# EasyEDA Pro project 数控电源_V3.eprj, schematic 电源板, sheet 1 of 2

## Sheets
1 主控3: Board Name: 电源板; Create Date: 2025-11-30; Page Name: 主控3; Project Name: 数控电源_V3; Schematic Name: 电源板; Update Date: 2025-11-30; Company: 嘉立创EDA; Page Size: A2; Version: V3
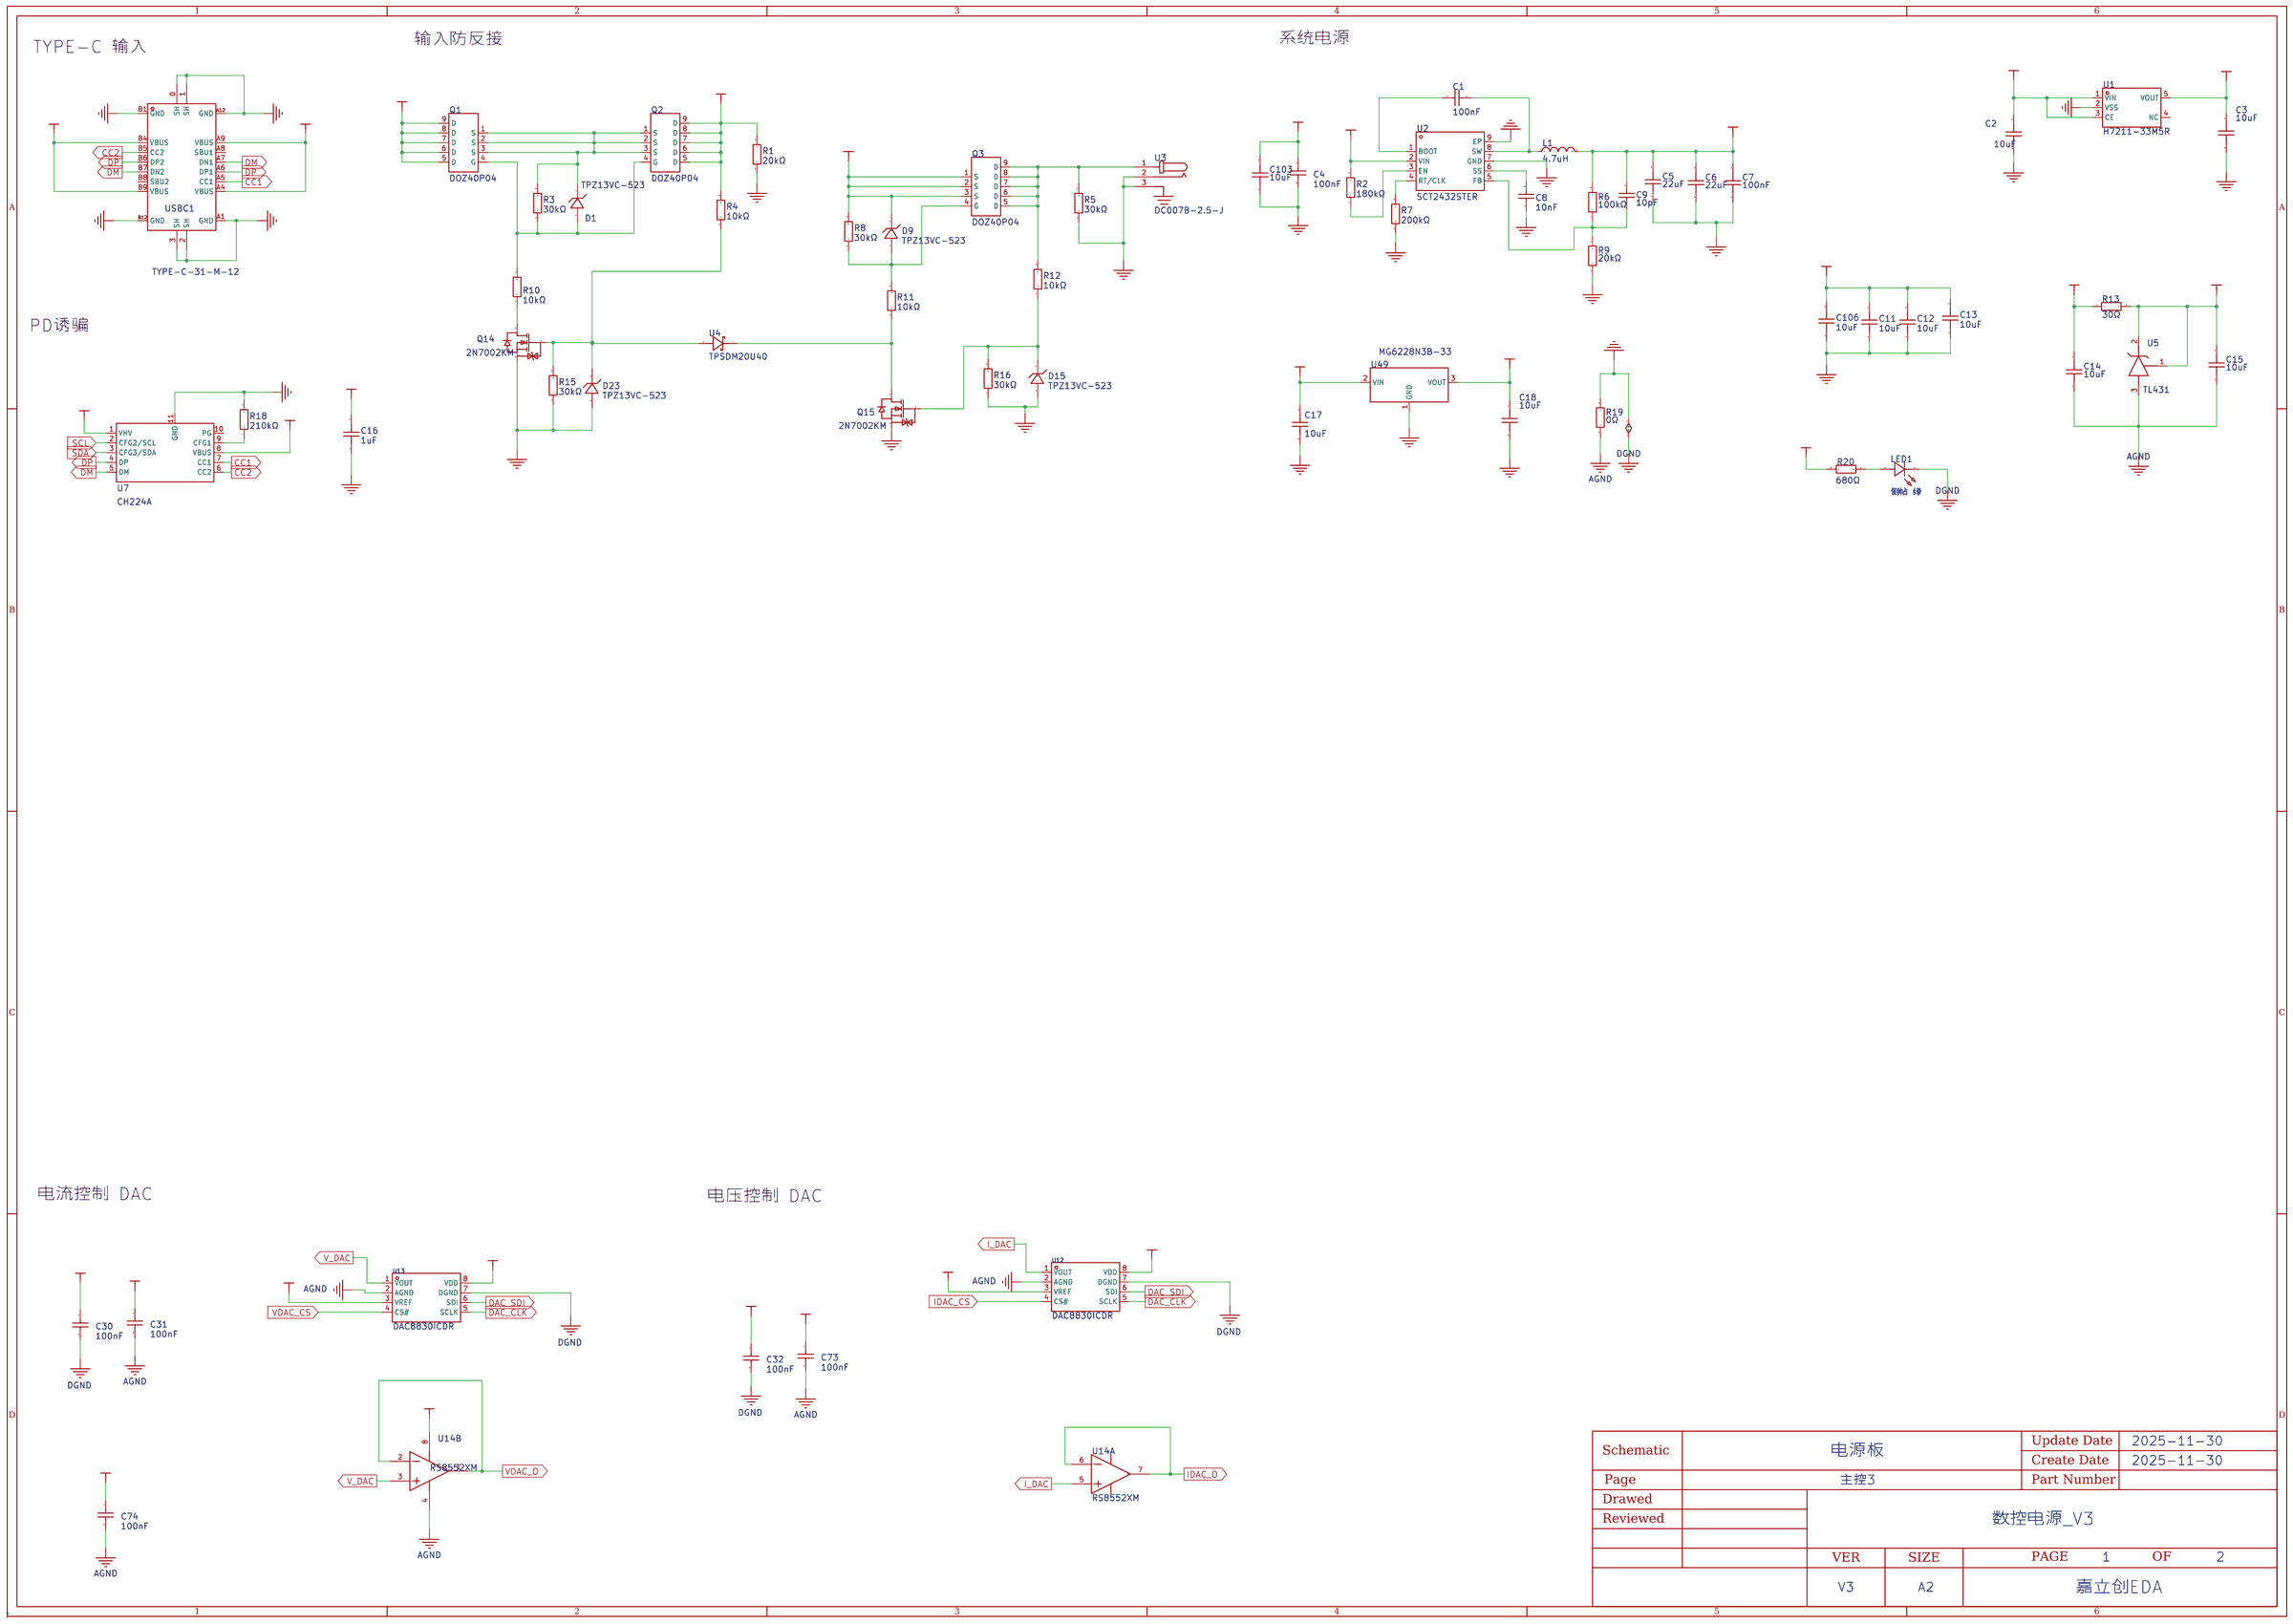
[diagram p3: 主控3]

## Parts
C1  100nF  [C0402]
C2  10uF  [电容0402]
C3  10uF  [电容0402]
C4  100nF  [C0402]
C5  22uF  [C0805]
C6  22uF  [C0805]
C7  100nF  [C0402]
C8  10nF  [C0402]
C9  10pF  [C0402]
C11  10uF  [C0402]
C12  10uF  [C0402]
C13  10uF  [C0402]
C14  10uF  [电容0603]
C15  10uF  [电容0603]
C16  1uF  [C0603]
C17  10uF  [电容0402]
C18  10uF  [电容0402]
C30  100nF  [C0402]
C31  100nF  [C0402]
C32  100nF  [C0402]
C73  100nF  [C0402]
C74  100nF  [C0402]
C103  10uF  [C0805]
C106  10uF  [C0402]
D1  TPZ13VC-523  [SOD-523_L1.2-W0.8-LS1.6-RD]
D9  TPZ13VC-523  [SOD-523_L1.2-W0.8-LS1.6-RD]
D15  TPZ13VC-523  [SOD-523_L1.2-W0.8-LS1.6-RD]
D23  TPZ13VC-523  [SOD-523_L1.2-W0.8-LS1.6-RD]
L1  4.7uH  [IND-SMD_L7.0-W6.6]
LED1  侧帖 绿  [LED-SMD_L1.7-W1.1-R-RD_GREEN]
Q1  DOZ40P04  [PDFN-8_L3.1-W3.1-P0.65-LS3.4-BL]
Q2  DOZ40P04  [PDFN-8_L3.1-W3.1-P0.65-LS3.4-BL]
Q3  DOZ40P04  [PDFN-8_L3.1-W3.1-P0.65-LS3.4-BL]
Q14  2N7002KM  [SOT-723-3_L1.2-W0.8-P0.80-LS1.2-BR]
Q15  2N7002KM  [SOT-723-3_L1.2-W0.8-P0.80-LS1.2-BR]
R1  20kΩ  [R0402]
R2  180kΩ  [R0402]
R3  30kΩ  [R0402]
R4  10kΩ  [R0402]
R5  30kΩ  [R0402]
R6  100kΩ  [R0402]
R7  200kΩ  [R0402]
R8  30kΩ  [R0402]
R9  20kΩ  [R0402]
R10  10kΩ  [R0402]
R11  10kΩ  [R0402]
R12  10kΩ  [R0402]
R13  30Ω  [R0805_NEW]
R15  30kΩ  [R0402]
R16  30kΩ  [R0402]
R18  210kΩ  [R0402]
R19  0Ω  [R1206]
R20  680Ω  [R0402]
U1  H7211-33M5R  [SOT-23-5_L3.0-W1.7-P0.95-LS2.8-BL]
U2  SCT2432STER  [ESOP-8_L4.9-W3.9-P1.27-LS6.0-BL-EP]
U3  DC007B-2.5-J  [DC-IN-TH_HX-DC007B-2.5]
U4  TPSDM20U40  [SOD-523_L1.2-W0.8-LS1.6-RD]
U5  TL431  [SOT-23-3_L2.9-W1.3-P1.90-LS2.4-BR]
U7  CH224A  [ESSOP-10_L4.9-W3.9-P1.0-LS6.0-TL-EP]
U12  DAC8830ICDR  [SOIC-8_L4.9-W3.9-P1.27-LS6.0-BL]
U13  DAC8830ICDR  [SOIC-8_L4.9-W3.9-P1.27-LS6.0-BL]
U14  RS8552XM  [MSOP-8_L3.0-W3.0-P0.65-LS4.9-BL]  (sections 1,2)
U49  MG6228N3B-33  [SOT-89-3_L4.5-W2.5-P1.50-LS4.2-BR]
USBC1  TYPE-C-31-M-12  [USB-C_SMD-TYPE-C-31-M-12]

## Library data of the parts
C1 C4 C30-C32 C73 C74 = CC0402KRX7R9BB104: 容值:100nF;精度:±10%;额定电压:50V;材质(温度系数):X7R;; LCSC Part Name: 100nF ±10% 50V; Supplier Part: C131394; Manufacturer: YAGEO(国巨); Supplier Footprint: 0402; JLCPCB Part Class: Extended Part; Datasheet: https://atta.szlcsc.com/upload/public/pdf/source/20170925/C131394_1506321459057990237.pdf; Supplier: LCSC; Tolerance: ±10%; Voltage Rated: 50V; Temperature Coefficient: X7R
C2 C3 C17 C18 = CL05A106MP5NUNC: 容值:10uF;精度:±20%;额定电压:10V;材质(温度系数):X5R;; LCSC Part Name: 10uF ±20% 10V; Supplier Part: C315248; Manufacturer: SAMSUNG(三星); Supplier Footprint: 0402; JLCPCB Part Class: Extended Part; Datasheet: https://atta.szlcsc.com/upload/public/pdf/source/20231220/1EF805BAE1520675928CC4638D279E74.pdf; Supplier: LCSC; Tolerance: ±20%; Voltage Rated: 10V; Temperature Coefficient: X5R
C5 C6 = CL21A226MAQNNNE_C45783: 容值:22uF;精度:±20%;额定电压:25V;材质(温度系数):X5R;; LCSC Part Name: 22uF ±20% 25V; Supplier Part: C45783; Manufacturer: SAMSUNG(三星); Manufacturer Part: CL21A226MAQNNNE; Supplier Footprint: 0805; JLCPCB Part Class: Basic Part; Datasheet: https://atta.szlcsc.com/upload/public/pdf/source/20160103/1457707727161.pdf; Supplier: LCSC; Tolerance: ±20%; Voltage Rated: 25V; Temperature Coefficient: X5R
C7 = CL05B104KB54PNC: 容值:100nF;精度:±10%;额定电压:50V;材质(温度系数):X7R;; LCSC Part Name: 100nF ±10% 50V; Supplier Part: C307331; Manufacturer: SAMSUNG(三星); Supplier Footprint: 0402; JLCPCB Part Class: Basic Part; Datasheet: https://atta.szlcsc.com/upload/public/pdf/source/20181009/C307331_222F7C870FD3EA5F46F538B483443886.pdf; Supplier: LCSC; Tolerance: ±10%; Voltage Rated: 50V; Temperature Coefficient: X7R
C8 = CC0402KRX7R9BB103: 容值:10nF;精度:±10%;额定电压:50V;材质(温度系数):X7R;; LCSC Part Name: 10nF ±10% 50V; Supplier Part: C60133; Manufacturer: YAGEO(国巨); Supplier Footprint: 0402; JLCPCB Part Class: 扩展库; Datasheet: https://atta.szlcsc.com/upload/public/pdf/source/20180224/C181747_15194369449651363981.pdf; Supplier: LCSC; Tolerance: ±10%; Voltage Rated: 50V; Temperature Coefficient: X7R
C9 = GRM1555C1H100JA01D: 容值:10pF;精度:±5%;额定电压:50V;材质(温度系数):C0G;; LCSC Part Name: 10pF ±5% 50V; Supplier Part: C76946; Manufacturer: muRata(村田); Supplier Footprint: 0402; JLCPCB Part Class: 扩展库; Datasheet: https://atta.szlcsc.com/upload/public/pdf/source/20180307/C76946_15204091154331407734.pdf; Supplier: LCSC; Tolerance: ±5%; Voltage Rated: 50V; Temperature Coefficient: C0G
C11-C13 C106 = HGC0402R5106M100NTEJ: 容值:10uF;精度:±20%;额定电压:10V;材质(温度系数):X5R;; LCSC Part Name: 10uF ±20% 10V; Supplier Part: C7472949; Manufacturer: Chinocera(华瓷); Supplier Footprint: 0402; JLCPCB Part Class: 扩展库; Datasheet: https://atta.szlcsc.com/upload/public/pdf/source/20240320/FAC3FEC40A78BC5CCCE96C232A94D860.pdf; Supplier: LCSC; Tolerance: ±20%; Voltage Rated: 10V; Temperature Coefficient: X5R
C14 C15 = 0603_10uF_10V: 容值:10uF;精度:±10%;额定电压:10V;材质(温度系数):X5R;; LCSC Part Name: 10uF ±10% 10V; Supplier Part: C19702; Manufacturer: SAMSUNG(三星); Manufacturer Part: CL10A106KP8NNNC; Supplier Footprint: 0603; JLCPCB Part Class: 基础库; Datasheet: https://atta.szlcsc.com/upload/public/pdf/source/20160103/1457707703378.pdf; Supplier: LCSC; Tolerance: ±10%; Voltage Rated: 10V; Temperature Coefficient: X5R
C16 = CL10A105KB8NNNC: 容值:1uF;精度:±10%;额定电压:50V;材质(温度系数):X5R;; LCSC Part Name: 1uF ±10% 50V; Supplier Part: C15849; Manufacturer: SAMSUNG(三星); Supplier Footprint: 0603; JLCPCB Part Class: Basic Part; Datasheet: https://atta.szlcsc.com/upload/public/pdf/source/20160103/1457707679084.pdf; Supplier: LCSC; Tolerance: ±10%; Voltage Rated: 50V; Temperature Coefficient: X5R
C103 = HGC0805R5106K500NSLJ: 容值:10uF;精度:±10%;额定电压:50V;温度系数:X5R;; LCSC Part Name: 10uF ±10% 50V; Supplier Part: C22367830; Manufacturer: Chinocera(华瓷); Supplier Footprint: 0805; JLCPCB Part Class: Extended Part; Datasheet: https://atta.szlcsc.com/upload/public/pdf/source/20240326/4C0A3E12027C78BBE9280625046EA2CF.pdf; Supplier: LCSC; Tolerance: ±10%; Voltage Rating: 50V; Temperature Coefficient: X5R
D1 D9 D15 D23 = LM5Z12VT1G: 二极管配置:独立式;稳压值(标称值):12V;稳压值(范围):11.4V~12.7V;功率(Pd):200mW;; Supplier Part: C131801; Manufacturer: LRC(乐山无线电); Supplier Footprint: SOD-523; JLCPCB Part Class: 扩展库; Datasheet: https://atta.szlcsc.com/upload/public/pdf/source/20190903/C383222_2E9F08E52083C1CC5E8563C6B9858127.pdf; Supplier: LCSC; Diode Configuration: 独立式; Zener Voltage (Nom): 12V; Zener Voltage (Range): 11.4V~12.7V; Power Dissipation: 200mW; Zener Impedance (Zzt): 25Ω
L1 = FXL0630-4R7-M: 电感值:4.7uH;精度:±20%;额定电流:6A;饱和电流(Isat):9A;类型:一体成型电感;; LCSC Part Name: 4.7uH ±20% 9A; Supplier Part: C167220; Manufacturer: cjiang(长江微电); Supplier Footprint: SMD,6.6x7mm; JLCPCB Part Class: 扩展库; Datasheet: https://atta.szlcsc.com/upload/public/pdf/source/20240426/3189EA8206330E2108542F9E34E540E7.pdf; Supplier: LCSC; Tolerance: ±20%; Rated Current: 6A; Saturation Current (Isat): 9A; DC Resistance (DCR): 33mΩ; Type: 一体成型电感
LED1 = XL-1606UGC: 发光颜色:翠绿;主波长:520nm~530nm;色温:-;功率:80mW;安装方式:侧贴;; LCSC Part Name: 翠绿 侧贴; Supplier Part: C965863; Manufacturer: XINGLIGHT(成兴光); Supplier Footprint: SMD,1.1x1.7mm; JLCPCB Part Class: 扩展库; Datasheet: https://atta.szlcsc.com/upload/public/pdf/source/20221102/94FA3AB05D9E652787BBD0AFAAE97065.pdf; Supplier: LCSC; Emitted Color: 翠绿; Lens Color: 无色透明; Dominant Wavelength: 520nm~530nm; Peak Wavelength: 535nm; Forward Current: 25mA; Power Dissipation: 80mW; Viewing Angle: 120°; Mounting Sytle: 侧贴; Operating Temperature: -30℃~+85℃
Q1-Q3 = DOZ40P04: 数量:1个P沟道;漏源电压(Vdss):40V;连续漏极电流(Id):40A;导通电阻(RDS(on)):15mΩ@10V;耗散功率(Pd):40W;阈值电压(Vgs(th)):2.5V@250uA;; Supplier Part: C42420925; Manufacturer: DOINGTER(杜因特); Supplier Footprint: DFN-8(3x3); Datasheet: https://atta.szlcsc.com/upload/public/pdf/source/20241224/BFD251454FAEA74D5A9CEDD45C52E1FA.pdf; Supplier: LCSC; Number: 1个P沟道; Drain to Source Voltage: 40V; Current - Continuous Drain(Id): 40A; RDS(on): 15mΩ@10V; Pd - Power Dissipation: 40W; Gate Threshold Voltage (Vgs(th)@Id): 2.5V@250uA; Gate Charge(Qg): 41nC@10V; Input Capacitance(Ciss): 3.119nF@20V; Reverse Transfer Capacitance (Crss@Vds): 215pF@20V; Operating Temperature: -55℃~+150℃; Type: P沟道; Output Capacitance(Coss): 270pF
Q14 Q15 = 2N7002KM_C7528888: 数量:1个N沟道;漏源电压(Vdss):60V;连续漏极电流(Id):340mA;导通电阻(RDS(on)):1.3Ω@10V,500mA;耗散功率(Pd):150mW;阈值电压(Vgs(th)):1V;; LCSC Part Name: N沟道,电流:0.34A,耐压:60V; Supplier Part: C7528888; Manufacturer: AM(安美); Supplier Footprint: SOT-723; JLCPCB Part Class: 扩展库; Datasheet: https://atta.szlcsc.com/upload/public/pdf/source/20231129/5C66841134DDA0BD991D299F08DBA333.pdf; Supplier: LCSC; Number: 1个N沟道; Drain to Source Voltage: 60V; Current - Continuous Drain(Id): 340mA; RDS(on): 1.3Ω@10V,500mA; Pd - Power Dissipation: 150mW; Gate Threshold Voltage (Vgs(th)@Id): 1V; Input Capacitance(Ciss@Vds): 40pF@10V; Reverse Transfer Capacitance (Crss@Vds): 10pF@10V; Operating Temperature: -55℃~+150℃
R1 R9 = 0402WGF2002TCE: 电阻类型:厚膜电阻;阻值:20kΩ;精度:±1%;功率:62.5mW;; LCSC Part Name: 20kΩ ±1% 62.5mW; Supplier Part: C25765; Manufacturer: UNI-ROYAL(厚声); Supplier Footprint: 0402; JLCPCB Part Class: 基础库; Datasheet: https://atta.szlcsc.com/upload/public/pdf/source/20200306/C422600_1E6D84923E4A46A82E41ADD87F860B5C.pdf; Supplier: LCSC; Type: 厚膜电阻; Tolerance: ±1%; Power(Watts): 62.5mW; Temperature Coefficient: ±100ppm/℃; Overload Voltage (Max): 50V; Operating Temperature Range: -55℃~+155℃
R2 = 0402WGF1803TCE: 电阻类型:厚膜电阻;阻值:180kΩ;精度:±1%;功率:62.5mW;最大工作电压:50V;温度系数:±100ppm/℃;; LCSC Part Name: 180kΩ ±1% 62.5mW 厚膜电阻; Supplier Part: C25760; Manufacturer: UNI-ROYAL(厚声); Supplier Footprint: 0402; JLCPCB Part Class: 扩展库; Datasheet: https://atta.szlcsc.com/upload/public/pdf/source/20200306/C422600_1E6D84923E4A46A82E41ADD87F860B5C.pdf; Supplier: LCSC; Type: 厚膜电阻; Tolerance: ±1%; Power(Watts): 62.5mW; Overload Voltage (Max): 50V; Temperature Coefficient: ±100ppm/℃; Operating Temperature Range: -55℃~+155℃
R3 R8 R15 R16 = RC0402FR-0730KL: 电阻类型:厚膜电阻;阻值:30kΩ;精度:±1%;功率:62.5mW;温度系数:±100ppm/℃;最大工作电压:50V;工作温度范围:-55℃~+155℃;; LCSC Part Name: 30kΩ ±1% 62.5mW; Supplier Part: C138008; Manufacturer: YAGEO(国巨); Supplier Footprint: 0402; JLCPCB Part Class: Extended Part; Datasheet: https://atta.szlcsc.com/upload/public/pdf/source/20171107/C138008_15100516356731096935.pdf; Supplier: LCSC; Type: 厚膜电阻; Tolerance: ±1%; Power(Watts): 62.5mW; Temperature Coefficient: ±100ppm/℃; Overload Voltage (Max): 50V; Operating Temperature Range: -55℃~+155℃
R4 R6 R10-R12 = RC0402FR-07100KL: 电阻类型:厚膜电阻;阻值:100kΩ;精度:±1%;功率:62.5mW;; LCSC Part Name: 100kΩ ±1% 62.5mW; Supplier Part: C60491; Manufacturer: YAGEO(国巨); Supplier Footprint: 0402; JLCPCB Part Class: Extended Part; Datasheet: https://atta.szlcsc.com/upload/public/pdf/source/20170518/1495086055123.pdf; Supplier: LCSC; Type: 厚膜电阻; Tolerance: ±1%; Power(Watts): 62.5mW; Temperature Coefficient: ±100ppm/℃; Overload Voltage (Max): 50V; Operating Temperature Range: -55℃~+155℃
R5 = FRC0402F3002TS: 电阻类型:厚膜电阻;阻值:30kΩ;精度:±1%;功率:62.5mW;工作电压:50V;温度系数:±100ppm/℃;; LCSC Part Name: 30kΩ ±1% 62.5mW 厚膜电阻; Supplier Part: C2909347; Manufacturer: FOJAN(富捷); Supplier Footprint: 0402; JLCPCB Part Class: Extended Part; Datasheet: https://atta.szlcsc.com/upload/public/pdf/source/20211221/925EC7D7225764EE0046F22065062C87.pdf; Supplier: LCSC; Type: 厚膜电阻; Tolerance: ±1%; Power(Watts): 62.5mW; Voltage-Supply(Max): 50V; Temperature Coefficient: ±100ppm/℃; Operating Temperature: -55℃~+155℃
R7 = 0402WGF2003TCE: 电阻类型:厚膜电阻;阻值:200kΩ;精度:±1%;功率:62.5mW;; LCSC Part Name: 200kΩ ±1% 62.5mW; Supplier Part: C25764; Manufacturer: UNI-ROYAL(厚声); Supplier Footprint: 0402; JLCPCB Part Class: 基础库; Datasheet: https://atta.szlcsc.com/upload/public/pdf/source/20200306/C422600_1E6D84923E4A46A82E41ADD87F860B5C.pdf; Supplier: LCSC; Type: 厚膜电阻; Tolerance: ±1%; Power(Watts): 62.5mW; Temperature Coefficient: ±100ppm/℃; Overload Voltage (Max): 50V; Operating Temperature Range: -55℃~+155℃
R13 = 0805W8F300JT5E: 电阻类型:厚膜电阻;阻值:30Ω;精度:±1%;功率:125mW;工作电压:150V;温度系数:±100ppm/℃;; LCSC Part Name: 30Ω ±1% 125mW 厚膜电阻; Supplier Part: C17622; Manufacturer: UNI-ROYAL(厚声); Supplier Footprint: 0805; JLCPCB Part Class: Extended Part; Datasheet: https://atta.szlcsc.com/upload/public/pdf/source/20200306/C422600_1E6D84923E4A46A82E41ADD87F860B5C.pdf; Supplier: LCSC; Type: 厚膜电阻; Tolerance: ±1%; Power(Watts): 125mW; Voltage-Supply(Max): 150V; Temperature Coefficient: ±100ppm/℃; Operating Temperature: -55℃~+155℃
R18 = 0402WGF1203TCE: 电阻类型:厚膜电阻;阻值:120kΩ;精度:±1%;功率:62.5mW;温度系数:±100ppm/℃;最大工作电压:50V;工作温度范围:-55℃~+155℃;; LCSC Part Name: 120kΩ ±1% 62.5mW; Supplier Part: C25750; Manufacturer: UNI-ROYAL(厚声); Supplier Footprint: 0402; JLCPCB Part Class: Basic Part; Datasheet: https://atta.szlcsc.com/upload/public/pdf/source/20200306/C422600_1E6D84923E4A46A82E41ADD87F860B5C.pdf; Supplier: LCSC; Type: 厚膜电阻; Tolerance: ±1%; Power(Watts): 62.5mW; Temperature Coefficient: ±100ppm/℃; Overload Voltage (Max): 50V; Operating Temperature Range: -55℃~+155℃
R19 = RS-06000JT: 阻值:0Ω;精度:±5%;功率:250mW;; LCSC Part Name: 0Ω ±5% 250mW; Supplier Part: C115323; Manufacturer: FH(风华); Supplier Footprint: 1206; JLCPCB Part Class: 扩展库; Datasheet: https://atta.szlcsc.com/upload/public/pdf/source/20170628/1498638561272.pdf; Supplier: LCSC; Tolerance: ±5%; Power(Watts): 250mW; Overload Voltage (Max): 200V; Operating Temperature Range: -55℃~+155℃
R20 = 0402WGF1001TCE: 电阻类型:厚膜电阻;阻值:1kΩ;精度:±1%;功率:62.5mW;温度系数:±100ppm/℃;最大工作电压:50V;工作温度范围:-55℃~+155℃;; LCSC Part Name: 1kΩ ±1% 62.5mW; Supplier Part: C11702; Manufacturer: UNI-ROYAL(厚声); Supplier Footprint: 0402; JLCPCB Part Class: Basic Part; Datasheet: https://atta.szlcsc.com/upload/public/pdf/source/20200306/C422600_1E6D84923E4A46A82E41ADD87F860B5C.pdf; Supplier: LCSC; Type: 厚膜电阻; Tolerance: ±1%; Power(Watts): 62.5mW; Temperature Coefficient: ±100ppm/℃; Overload Voltage (Max): 50V; Operating Temperature Range: -55℃~+155℃
U1 = H7211-33M5R: 输出类型:固定;输出极性:正;输出通道数:1;最大输入电压:6V;输出电压:3.3V;压差:220mV@(150mA);输出电流:300mA;电源纹波抑制比(PRSS):80dB@(217Hz),70dB@(10kHz);; Supplier Part: C411019; Manufacturer: Siproin(上海矽朋); Supplier Footprint: SOT23-5; JLCPCB Part Class: Extended Part; Datasheet: https://atta.szlcsc.com/upload/public/pdf/source/20190808/C411019_2CD9A792A5B8D59F2DF11945999533FD.pdf; Supplier: LCSC; Output Type: 固定; Output Polarity: 正; Number of Outputs: 1; Maximum Input Voltage: 6V; Output Voltage: 3.3V; Dropout Voltage: 220mV@(150mA); Output Current: 300mA; Power Supply Rejection Ratio (PRSS): 80dB@(217Hz),70dB@(10kHz)
U2 = SCT2432STER: Supplier Part: C509398; Manufacturer: SCT(芯洲科技); Supplier Footprint: ESOP-8; JLCPCB Part Class: Extended Part; Datasheet: https://atta.szlcsc.com/upload/public/pdf/source/20200407/C509398_ED6AA8BA584D0E945F1EA22ED56DC8F2.pdf; Supplier: LCSC
U3 = DC007B-2.5-J: 连接器类型:DC电源插座;安装方式:弯插;触点内径:2.5mm;触点外径:6.4mm;额定电流:7A;额定电压:20V;工作温度范围:-25℃~+70℃;; LCSC Part Name: DC电源插座 内径:2.5mm 外径:6.4mm; Supplier Part: C17701686; Manufacturer: SHOU HAN(首韩); Supplier Footprint: 插件; JLCPCB Part Class: 扩展库; Datasheet: https://atta.szlcsc.com/upload/public/pdf/source/20230912/096E410C8959A676A74C85008D887774.pdf; Supplier: LCSC; Connector Type: DC电源插座; Mounting Style: 弯插; Inside Contact Diameter: 2.5mm; Outside Contact Diameter: 6.4mm; Current Rating (Max): 7A; Voltage Rating (Max): 20V; Operating Temperature Range: -25℃~+70℃
U4 = TPSDM20U40: 正向压降(Vf):600mV@200mA;直流反向耐压(Vr):40V;整流电流:350mA;; Supplier Part: C48886839; Manufacturer: TECH PUBLIC(台舟); Supplier Footprint: SOD-523; JLCPCB Part Class: Extended Part; Datasheet: https://atta.szlcsc.com/upload/public/pdf/source/20250509/9FEC9DF30CB865A402E2A7B28D5BA719.pdf; Supplier: LCSC; Voltage - Forward(Vf@If): 600mV@200mA; Voltage - DC Reverse(Vr): 40V; Current - Rectified: 350mA; Reverse Leakage Current (Ir): 5uA@30V; Operating Junction Temperature Range: -40℃~+125℃; Non-Repetitive Peak Forward Surge Current: 2A
U5 = TL431: 输出类型：可调式 输出电压：2.5V~36V 输出电流：100mA 最小阴极电流调节：1mA 工作温度：-25℃~+85℃@(TA) 精度±0.5% SOT-23; LCSC Part Name: 2.5V~36V 100mA; Supplier Part: C3025162; Manufacturer: GOODWORK(固得沃克); Supplier Footprint: SOT-23; Datasheet: https://atta.szlcsc.com/upload/public/pdf/source/20220530/D563F3F76B74841F8CC59453CCFB0ABC.pdf; Supplier: LCSC
U7 = CH224A: 支持USB PD3.2的USB PD快充协议受电芯片，最高支持PD3.2 EPR 140W功率,可广泛用于各类电子设备拓展高功率输入如无线充电器、小家电、锂电池电动工具等各类场合。; Supplier Part: C42459160; Manufacturer: WCH(南京沁恒); Supplier Footprint: ESSOP-10; JLCPCB Part Class: 扩展库; Datasheet: https://atta.szlcsc.com/upload/public/pdf/source/20250227/6D68A1393FFD6E9F0B2393231A5DDBA5.pdf; Supplier: LCSC
U12 U13 = DAC8830ICDR: 接口:SPI;电源电压:2.7V~5.5V;分辨率:16位;INL/DNL:±0.5LSB；±0.5LSB;稳定时间:1us;; Supplier Part: C527455; Manufacturer: TI(德州仪器); Supplier Footprint: SOIC-8; JLCPCB Part Class: 扩展库; Datasheet: https://www.ti.com/cn/lit/gpn/dac8831; Supplier: LCSC; Interface: SPI; Output Type: 电压-非缓冲; Supply Voltage: 2.7V~5.5V; Resolution: 16位; Integral nonlinearity: ±0.5LSB；±0.5LSB; Settling Time: 1us; Operating Temperature: -40℃~+85℃
U14 = RS8552XM: 放大器组数:2;增益带宽积(GBP):4.5MHz;压摆率(SR):2.5V/us;; Supplier Part: C236998; Manufacturer: RUNIC(润石); Supplier Footprint: MSOP-8; JLCPCB Part Class: 扩展库; Datasheet: https://atta.szlcsc.com/upload/public/pdf/source/20180704/C236998_2EA4A60C035D21B482DEA1E435D9107D.pdf; Supplier: LCSC; Number of Circuits: 2; Gain Bandwidth Product(GBP): 4.5MHz; Slew Rate(SR): 2.5V/us; Supply Voltage: 2.7V~5.5V; Operating Temperature: -40℃~+125℃
U49 = SL9013M33SQ: 输出类型:固定;工作电压:6.5V;输出电压:3.3V;输出电流:500mA;电源纹波抑制比(PSRR):75dB@(1kHz);输出极性:正极;; Supplier Part: C48678126; Manufacturer: Slkor(萨科微); Supplier Footprint: SOT-89; JLCPCB Part Class: 扩展库; Datasheet: https://atta.szlcsc.com/upload/public/pdf/source/20220805/3ADCC752D1C673357322F941587FC7CC.pdf; Supplier: LCSC; Output Type: 固定; Voltage - Supply: 6.5V; Output Voltage: 3.3V; Output Current: 500mA; Power Supply Rejection Ratio (PSRR): 75dB@(1kHz); Voltage Dropout: 100mV@(100mA); standby current: 70uA; Noise: 50uVrms; Operating Temperature: -40℃~+85℃@(Ta); Output Configuration: 正极; Number of Outputs: 1
USBC1 = TYPE-C- 16PIN-5A: TYPE-C 16pin 5A大电流; LCSC Part Name: Type-C 母座; Supplier Part: C165948; Manufacturer: 韩国韩荣; Supplier Footprint: SMD; JLCPCB Part Class: 扩展库; Datasheet: https://atta.szlcsc.com/upload/public/pdf/source/20220525/466408E853115E789EDB0DDC29077C05.pdf; Supplier: LCSC; Connector Type: Type-C; Gender: 母座; Number of Contacts: 16; Number of Ports: 1; Current Rating - Power (Max): 5A

## Nets
+3.3V: C11.2 C12.2 C13.2 C18.1 C30.1 C32.1 C106.2 R20.1 U12.8(VDD) U13.8(VDD) U49.3(VOUT) ; also on sheet 2
+4.8V: C2.1 C5.2 C6.2 C7.2 C9.2 C17.1 L1.2 R6.2 U1.1(VIN) U1.3(CE) U49.2(VIN) ; also on sheet 2
AGND: C2.2 C3.2 C14.1 C15.1 C31.2 C73.2 C74.2 R19.2 U1.2(VSS) U5.3(A) U12.2(AGND) U13.2(AGND) U14.4(V-) ; also on sheet 2
DGND: C4.2 C5.1 C6.1 C7.1 C8.1 C11.1 C12.1 C13.1 C16.1 C17.2 C18.2 C30.2 C32.2 C103.1 C106.1 D15.2(A) D23.2(A) LED1.2(K) Q14.2(S) Q15.2(S) R1.1 R5.1 R7.1 R9.1 R15.1 R16.1 R18.2 R19.1 U2.7(GND) U2.9(EP) U3.2 U3.3 U7.11(GND) U12.7(DGND) U13.7(DGND) U49.1(GND) USBC1.0(SH) USBC1.1(SH) USBC1.2(SH) USBC1.3(SH) USBC1.A1(GND) USBC1.A12(GND) USBC1.B1(GND) USBC1.B12(GND) ; also on sheet 2
VIN: C4.1 C103.2 D9.1(C) Q1.5(D) Q1.6(D) Q1.7(D) Q1.8(D) Q1.9(D) Q3.1(S) Q3.2(S) Q3.3(S) R2.2 R8.2 U2.2(VIN) ; also on sheet 2
A+2.5V: C15.2 C31.1 C73.1 R13.2 U5.1(REF) U5.2(K) U12.3(VREF) U13.3(VREF)
A+3.3V: C3.1 C14.2 C74.1 R13.1 U1.5(VOUT) U14.8(V+) ; also on sheet 2
CC1: U7.7(CC1) USBC1.A5(CC1)
CC2: U7.6(CC2) USBC1.B5(CC2)
DAC_CLK: U12.5(SCLK) U13.5(SCLK)
DAC_SDI: U12.6(SDI) U13.6(SDI)
DM: U7.5(DM) USBC1.A7(DN1) USBC1.B7(DN2)
DP: U7.4(DP) USBC1.A6(DP1) USBC1.B6(DP2)
I_DAC: U12.1(VOUT) U14.5(+IN 2)
IDAC_CS: U12.4(CS#)
IDAC_O: U14.6(-IN 2) U14.7(OUT 2) ; also on sheet 2
SCL: U7.2(CFG2/SCL) ; also on sheet 2
SDA: U7.3(CFG3/SDA) ; also on sheet 2
USB-VIN: C16.2 Q2.5(D) Q2.6(D) Q2.7(D) Q2.8(D) Q2.9(D) R1.2 R4.2 U7.1(VHV) U7.8(VBUS) USBC1.A4(VBUS) USBC1.A9(VBUS) USBC1.B4(VBUS) USBC1.B9(VBUS)
V_DAC: U13.1(VOUT) U14.3(+IN 1)
VDAC_CS: U13.4(CS#)
VDAC_O: U14.1(OUT 1) U14.2(-IN 1) ; also on sheet 2
$2N122357: C9.1 R6.1 R9.2 U2.5(FB)
$2N125522: C1.2 L1.1 U2.8(SW)
$2N128671: C1.1 U2.1(BOOT)
$2N128919: R2.1 U2.3(EN)
$2N129016: C8.2 U2.6(SS)
$2N129121: R7.2 U2.4(RT/CLK)
$2N136547: LED1.1(A) R20.2
$2N196551: R18.1 U7.9(CFG1)
$2N255770: Q3.5(D) Q3.6(D) Q3.7(D) Q3.8(D) Q3.9(D) R5.2 R12.2 U3.1
$2N258786: D9.2(A) Q3.4(G) R8.1 R11.2
$2N259137: Q15.3(D) R11.1 U4.1(K)
$2N259374: D1.1(C) Q1.1(S) Q1.2(S) Q1.3(S) Q2.1(S) Q2.2(S) Q2.3(S) R3.2
$2N259912: D15.1(C) Q15.1(G) R12.1 R16.2
$2N267241: Q14.3(D) R10.2
$2N267271: D1.2(A) Q1.4(G) Q2.4(G) R3.1 R10.1
$2N267417: D23.1(C) Q14.1(G) R4.1 R15.2 U4.2(A)

Not connected (* = marked no-connect by the designer): U1 4(NC); U7 10(PG); USBC1 A8(SBU1) B8(SBU2)

## Notes on the sheets
sheet 1
- TYPE-C 输入
- 输入防反接
- 系统电源
- PD诱骗
- 电流控制 DAC
- 电压控制 DAC
